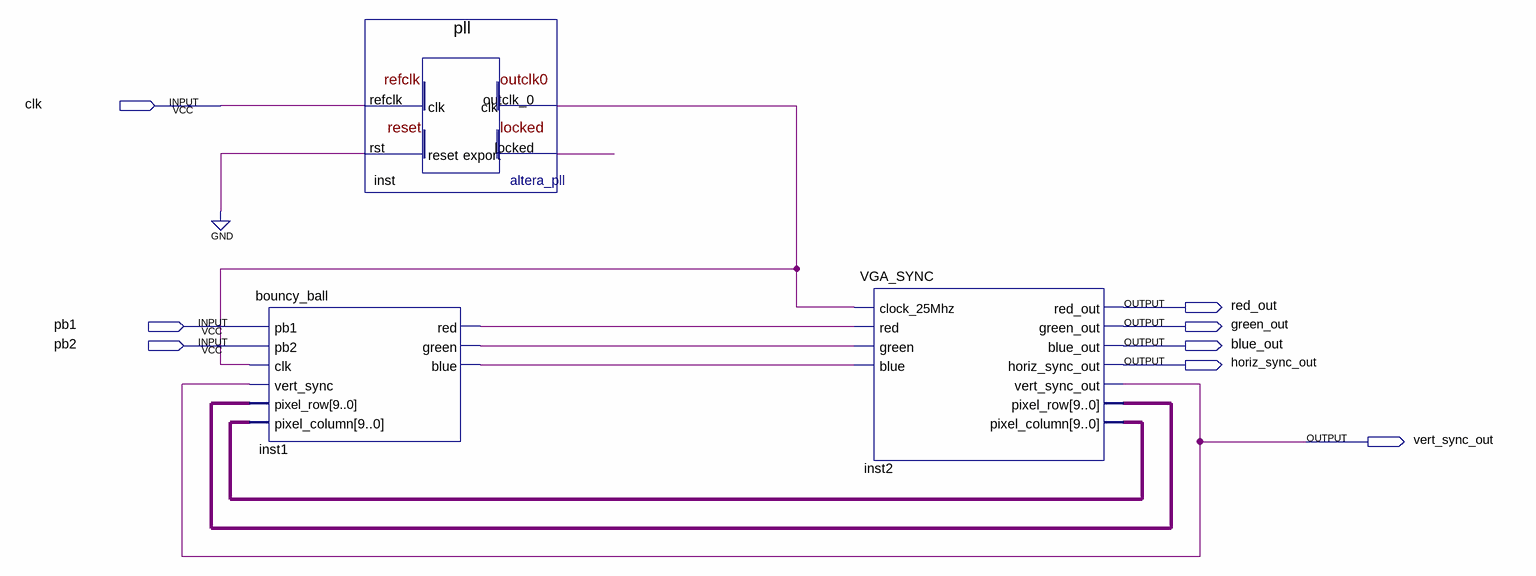
[diagram p0: schematic sheet]
// Quartus schematic high_lvl_entity.bdf as structural Verilog: 3 symbols, 8 pins
module high_lvl_entity (
  input  clk,
  input  pb1,
  input  pb2,
  output red_out,
  output green_out,
  output blue_out,
  output horiz_sync_out,
  output vert_sync_out
);

  wire inst1_blue, inst1_green, inst1_red, inst_locked, inst_outclk_0;
  wire [9:0] inst2_pixel_column, inst2_pixel_row;

  bouncy_ball inst1 (
    .pb1(pb1), .pb2(pb2), .clk(inst_outclk_0), .vert_sync(vert_sync_out), .pixel_row(inst2_pixel_row),
    .pixel_column(inst2_pixel_column), .red(inst1_red), .green(inst1_green), .blue(inst1_blue));
  pll inst (.refclk(clk), .rst(1'b0), .outclk_0(inst_outclk_0), .locked(inst_locked));
  VGA_SYNC inst2 (
    .clock_25Mhz(inst_outclk_0), .red(inst1_red), .green(inst1_green), .blue(inst1_blue), .red_out(red_out),
    .green_out(green_out), .blue_out(blue_out), .horiz_sync_out(horiz_sync_out),
    .vert_sync_out(vert_sync_out), .pixel_row(inst2_pixel_row), .pixel_column(inst2_pixel_column));
endmodule
